# Altium project USB-C_BREAKOUT.PrjPcb
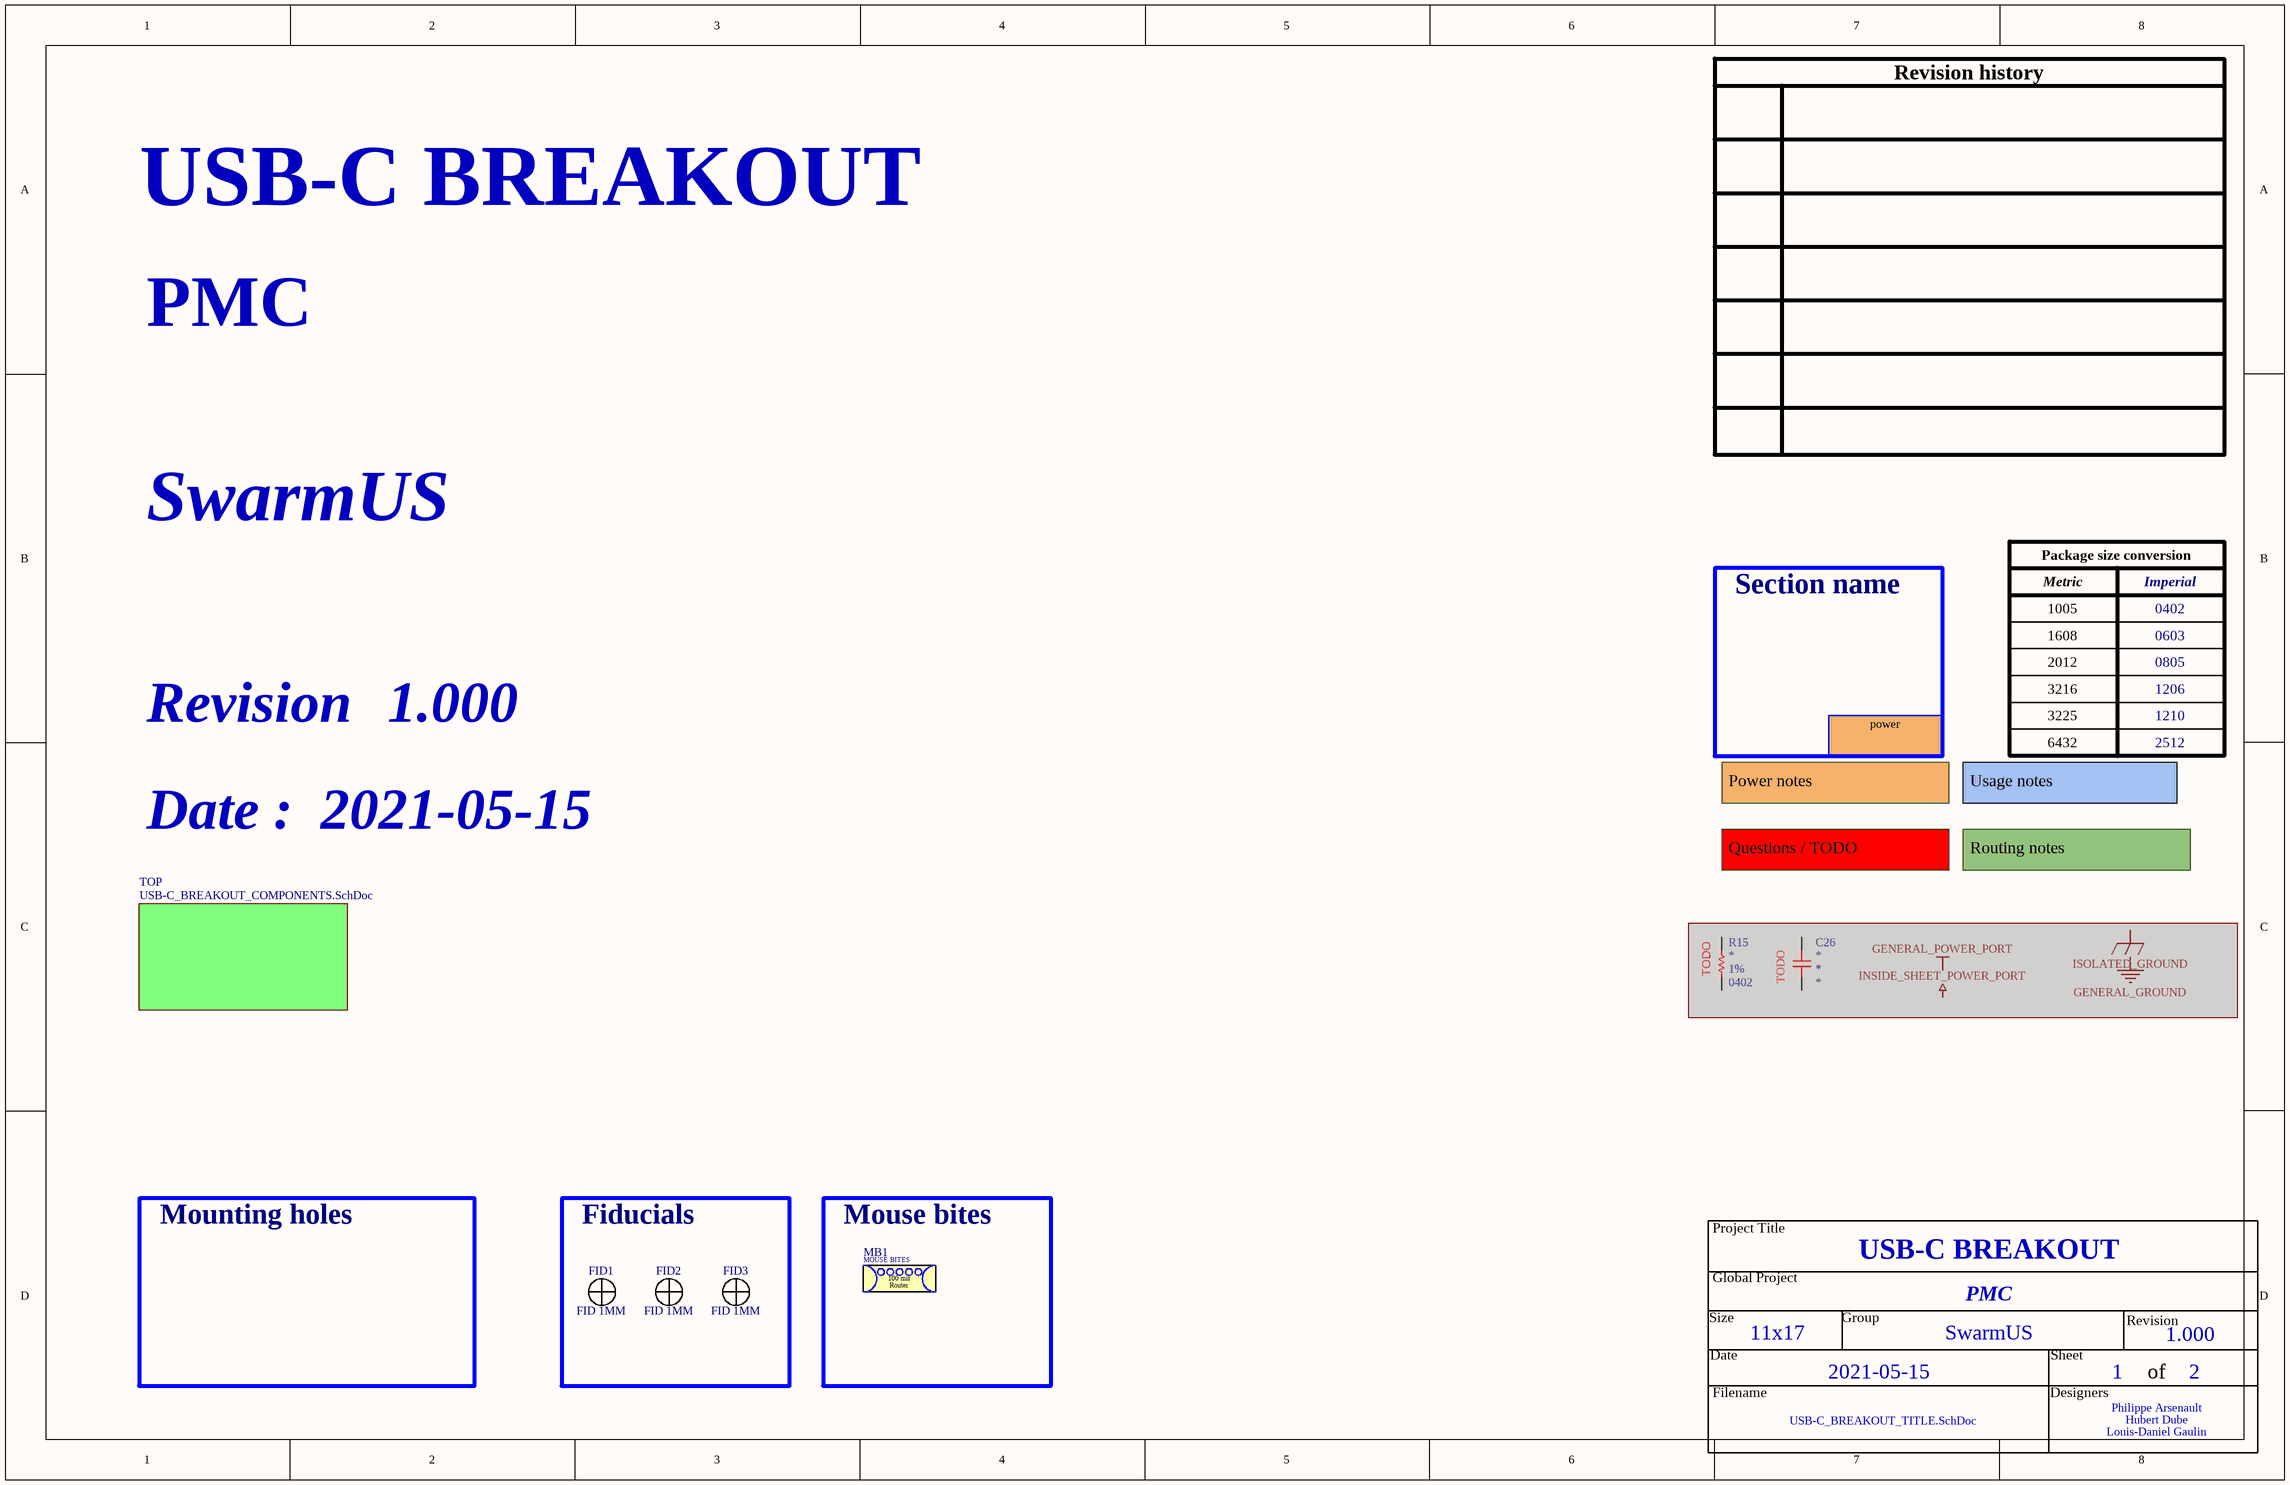
[diagram p0: USB-C_BREAKOUT_TITLE.SchDoc]
Project_Date: 2021-05-15; Project_Designer1: Philippe Arsenault; Project_Designer2: Hubert Dube; Project_Designer3: Louis-Daniel Gaulin; Project_Global: PMC; Project_Group: SwarmUS; Project_Name: USB-C BREAKOUT; Project_Revision: 1.000; Project_Stencil_Bot_Thickness: 0.1 MM; Project_Stencil_Top_Thickness: 0.1 MM
2 sheets, 21 parts. Net scope: hierarchical (ports join the sheet entries above them; power ports are global).
Board files: USB-C_BREAKOUT.PcbDoc, USB-C_BREAKOUT_PANNEL.PcbDoc
Sheets:
  USB-C_BREAKOUT_TITLE.SchDoc
    TOP = USB-C_BREAKOUT_COMPONENTS.SchDoc

## Sheet USB-C_BREAKOUT_TITLE.SchDoc
size Tabloid; DocumentNumber: 1; SheetNumber: 1; SheetTotal: 2; Sheet_Name: Title sheet; Size: 11x17

### Parts
C26  PRELIM  [CAP_CER_1812]  (value not drawn)  (masked out: inside a compile mask, not in the netlist)
FID1  FID 1MM  [FID_CIRCLE_1MM]
FID2  FID 1MM  [FID_CIRCLE_1MM]
FID3  FID 1MM  [FID_CIRCLE_1MM]
MB1  MOUSE BITES  [PNL_MOUSEBITES_100MIL_5-HOLES]  (no BOM)
R15  Tolerance: 1%  Package: 0402  [RES_0402]  (hidden comment: PRELIM)  (masked out: inside a compile mask, not in the netlist)

### Blocks framed on the sheet
Fiducials: FID1-FID3
Mouse bites: MB1

### Sub-sheets
TOP = USB-C_BREAKOUT_COMPONENTS.SchDoc: no entries

### Nets

Not connected (* = marked no-connect by the designer): FID1 1 2; FID2 1 2; FID3 1 2

### Notes on the sheet
- Section name
- power
- Power notes
- Usage notes
- Questions / TODO
- Routing notes
- Mounting holes
- Revision history
- Package size conversion
- Metric
- 1005
- 1608
- Imperial
- 0402
- 0603
- Revision
- 2012
- 3216
- 0805
- 1206
- 3225
- 6432
- 1210
- 2512
- Date :
- Project Title
- Global Project
- Size
- Date
- Group
- Sheet
- of
- Filename
- Designers
- (in symbol CAP_CER_PRELIM) TODO
- (in symbol PNL_MOUSEBITES_100MIL_5-HOLES) 100 mil; Router
- (in symbol RES_PRELIM) TODO

### Library data of the parts
C26 = CAP_CER_PRELIM: CAP - CER PRELIM; Manufacturer #1: Würth Elektronik; Part Number #1: 885342211009; Tolerance: 10%; GRAMS Lib Spec: 2.8; Magnetic Material: Unknown; Polarized: No; Current Rating: *; Power Max: *; HelpURL: http://www.vishay.com/docs/45228/hvseries.pdf; CreatedBy/Date: Hubert Dube - 03/02/2021; Temperature: -55°C ~ 125°C; Manufacturer #2: *; Note: *; Assembly Type: SMD; Part Number #2: *; Cryo: UNKNOWN; Supplier 1: Digi-Key; Supplier Part Number 1: 732-12109-1-ND; Package: *; Voltage Rating: *; Value: *
FID1-FID3 = FID_CIRCLE_1MM: FID - FIDUCIAL 1MM CIRCLE DOUBLE-SIDED - 1MM; GRAMS Lib Spec: 2.8; Magnetic Material: NO; Cryo: UNKNOWN; Value: *; Tolerance: *; Voltage Rating: *; Current Rating: *; Power Max: *; HelpURL: https://www.pcb-3d.com/wordpress/wp-content/uploads/ipc-sm-782a_amendment_1_and_2.pdf; CreatedBy/Date: Jonathan Bouchard 2018-07-23; VerifiedBy: Caroline Paulin - 25 juillet 2018; Temperature: *; Package: 1MM CIRCLE; Manufacturer #1: *; Manufacturer #2: *; Note: *; Assembly Type: NONE; Part Number #2: *; Part Number #1: *; Polarized: *; Supplier 1: *; Supplier Part Number 1: *
MB1 = PNL_MOUSEBITES_100MIL_5-HOLES: PNL - MOUSE BITES 100 MIL - 5-TH; GRAMS Lib Spec: 2.8; Magnetic Material: NO; Rule: UNIONINDEX=0|RULEKIND=ComponentClearance|NETSCOPE=AnyNet|LAYERKIND=SameLayer|NAME=Schematic Component Clearance Constraint|GAP=0mil|COLLISIONCHECKMODE=3|VERTICALGAP=0mil|SHOWDISTANCES=FALSE|UNIT=Imperial; Rule: UNIONINDEX=0|RULEKIND=PlaneClearance|NETSCOPE=AnyNet|LAYERKIND=SameLayer|NAME=Schematic Power Plane Clearance|CLEARANCE=20mil|UNIT=Imperial; Cryo: UNKNOWN; Value: *; Tolerance: *; Voltage Rating: *; Current Rating: *; Power Max: *; HelpURL: *; CreatedBy/Date: Jonathan Bouchard 2019-04-15; VerifiedBy: Caroline Paulin - 24 mai 2019; Temperature: *; Package: *; Manufacturer #1: *; Manufacturer #2: *; Note: *; Assembly Type: NONE; Part Number #2: *; Part Number #1: *; Polarized: *; Supplier 1: *; Supplier Part Number 1: *
R15 = RES_PRELIM: RES -PRELIM; Manufacturer #1: Yageo; Part Number #1: RC0402FR-0775RL; GRAMS Lib Spec: 2.8c; Power Max: 1/16W; Magnetic Material: Unknown; Polarized: No; Voltage Rating: 50V; Assembly Type: SMD; CreatedBy/Date: Hubert Dubé - 3/02/2020; Current Rating: *; HelpURL: https://www.yageo.com/upload/media/product/productsearch/datasheet/rchip/PYu-RC_Group_51_RoHS_L_11.pdf; Manufacturer #2: *; Note: *; Part Number #2: *; Temperature: -55°C ~ 155°C; Value: *

## Sheet USB-C_BREAKOUT_COMPONENTS.SchDoc
size Tabloid; DocumentNumber: 2; SheetNumber: 2; SheetTotal: 2; Sheet_Name: USB-C Breakout; Size: 11x17
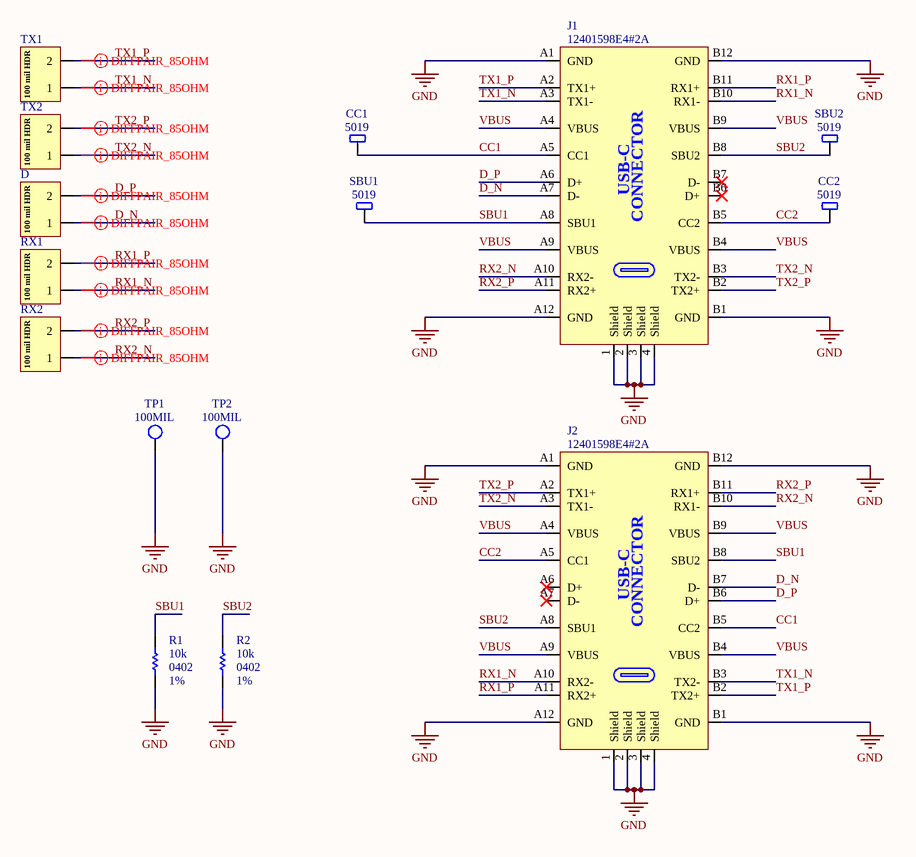
[diagram p1: USB-C_BREAKOUT_COMPONENTS.SchDoc]

### Parts
CC1  5019  [TPO_SMD_5019]
CC2  5019  [TPO_SMD_5019]
D  TS-102-G-A  [CON_HDR_TS-102-G-A]  (value not drawn)
J1  12401598E4#2A  [CON_USB_3.2_TypeC_12401598E4#2A]
J2  12401598E4#2A  [CON_USB_3.2_TypeC_12401598E4#2A]
R1  value 10k  Tolerance: 1%  Package: 0402  [RES_0402]  (hidden comment: RC0402FR-0710KL)
R2  value 10k  Tolerance: 1%  Package: 0402  [RES_0402]  (hidden comment: RC0402FR-0710KL)
RX1  TS-102-G-A  [CON_HDR_TS-102-G-A]  (value not drawn)
RX2  TS-102-G-A  [CON_HDR_TS-102-G-A]  (value not drawn)
SBU1  5019  [TPO_SMD_5019]
SBU2  5019  [TPO_SMD_5019]
TP1  100MIL  [TPO_TH_ROUND_100MIL]  (no BOM)
TP2  100MIL  [TPO_TH_ROUND_100MIL]  (no BOM)
TX1  TS-102-G-A  [CON_HDR_TS-102-G-A]  (value not drawn)
TX2  TS-102-G-A  [CON_HDR_TS-102-G-A]  (value not drawn)

### Nets
GND: J1.1(Shield) J1.2(Shield) J1.3(Shield) J1.4(Shield) J1.A1(GND) J1.A12(GND) J1.B1(GND) J1.B12(GND) J2.1(Shield) J2.2(Shield) J2.3(Shield) J2.4(Shield) J2.A1(GND) J2.A12(GND) J2.B1(GND) J2.B12(GND) R1.2 R2.2 TP1.1 TP2.1
CC1: CC1.1 J1.A5(CC1) J2.B5(CC2)
CC2: CC2.1 J1.B5(CC2) J2.A5(CC1)
D_N: D.1 J1.A7(D-) J2.B7(D-)
D_P: D.2 J1.A6(D+) J2.B6(D+)
RX1_N: J1.B10(RX1-) J2.A10(RX2-) RX1.1
RX1_P: J1.B11(RX1+) J2.A11(RX2+) RX1.2
RX2_N: J1.A10(RX2-) J2.B10(RX1-) RX2.1
RX2_P: J1.A11(RX2+) J2.B11(RX1+) RX2.2
SBU1: J1.A8(SBU1) J2.B8(SBU2) R1.1 SBU1.1
SBU2: J1.B8(SBU2) J2.A8(SBU1) R2.1 SBU2.1
TX1_N: J1.A3(TX1-) J2.B3(TX2-) TX1.1
TX1_P: J1.A2(TX1+) J2.B2(TX2+) TX1.2
TX2_N: J1.B3(TX2-) J2.A3(TX1-) TX2.1
TX2_P: J1.B2(TX2+) J2.A2(TX1+) TX2.2
VBUS: J1.A4(VBUS) J1.A9(VBUS) J1.B4(VBUS) J1.B9(VBUS) J2.A4(VBUS) J2.A9(VBUS) J2.B4(VBUS) J2.B9(VBUS)

Not connected (* = marked no-connect by the designer): J1 B6(D+)* B7(D-)*; J2 A6(D+)* A7(D-)*

### Layout directives
differential pair; differential pair class DIFF_85; net class DIFF: D_N, D_P, RX1_N, RX1_P, RX2_N, RX2_P, TX1_N, TX1_P, TX2_N, TX2_P

### Notes on the sheet
- Sheet Name
- Project Title
- Global Project
- Size
- Group
- Revision
- Date
- Sheet
- of
- Filename
- Designers
- (in symbol CON_HDR_TS-102-G-A) 100 mil HDR
- (in symbol CON_USB_3.2_TypeC_12401598E4#2A) USB-C; CONNECTOR

### Library data of the parts
CC1 CC2 SBU1 SBU2 = TPO_SMD_5019: TPO - PC TEST POINT MINI - SMD; Manufacturer #1: Keystone Electronics; Value: 3.81mm x 2.03mm; Polarized: No; Magnetic Material: UNKNOWN; GRAMS Lib Spec: 2.8; Current Rating: *; Manufacturer #2: *; Note: *; Power Max: *; Part Number #2: *; HelpURL: https://www.digikey.ca/product-detail/en/keystone-electronics/5019/36-5019CT-ND/3907344; Supplier 1: Digi-Key; Supplier Part Number 1: 36-5019CT-ND; Assembly Type: SMD; Part Number #1: 5019; Package: SMD; CreatedBy/Date: Olivier Bernard / 5/12/2017; Temperature: *; Tolerance: *; VerifiedBy: Caroline Paulin / 5 juillet 2018; Voltage Rating: *; Cryo: UNKNOWN
D RX1 RX2 TX1 TX2 = CON_HDR_TS-102-G-A: CON - HDR 2 position 0.100" - TH; Manufacturer #1: Samtec Inc.; GRAMS Lib Spec: 2.8; Magnetic Material: Unknown; Polarized: No; Assembly Type: TH; CreatedBy/Date: Joel Lemay 2018-06-19; Current Rating: *; HelpURL: http://suddendocs.samtec.com/prints/tx-1xx-x-x-mkt1.pdf; Manufacturer #2: *; Package: TH; Part Number #2: *; Power Max: *; Supplier 1: Digi-Key; Supplier Part Number 1: SAM1111-02-ND; Temperature: -55°C ~ 125°C; Tolerance: *; Value: *; VerifiedBy: Caroline Paulin - 10 sept 2018; Voltage Rating: *; Part Number #1: TS-102-G-A; Cryo: UNKNOWN
J1 J2 = CON_USB_3.2_TypeC_12401598E4#2A: CON_USB - USB 3.2 Gen 2 (USB 3.1 Gen 2, Superspeed + (USB 3.1)) 24 pos Receptacle - R/A; Manufacturer #1: Amphenol ICC (Commercial Products); Value: USB 3.2 Type C; Current Rating: 5A total; GRAMS Lib Spec: 2.8; Magnetic Material: Unknown; Polarized: Yes; Voltage Rating: -; Power Max: -; HelpURL: https://www.amphenol-icc.com/media/wysiwyg/files/drawing/12401598xxx2a.pdf; CreatedBy/Date: Louis-Daniel Gaulin / 07-04-2021; VerifiedBy: Philippe Arsenault/2021-04-08; Temperature: max 105°C; Package: SMD + TH R/A; Assembly Type: SMD + TH; Part Number #1: 12401598E4#2A; Supplier 1: Digi-Key; Supplier Part Number 1: 12401598E4#2ACT-ND
R1 R2 = RES_RC0402FR-0710KL: RES - 10K OHMS 1% 1/16W - 0402; Manufacturer #1: Yageo; GRAMS Lib Spec: 2.8; Magnetic Material: UNKNOWN; Polarized: NO; Voltage Rating: 50V; Assembly Type: SMD; CreatedBy/Date: Nicolas V. (2018-11-20); Current Rating: *; HelpURL: http://www.yageo.com/documents/recent/PYu-RC_Group_51_RoHS_L_9.pdf; Manufacturer #2: *; Note: *; Part Number #1: RC0402FR-0710KL; Part Number #2: *; Power Max: 1/16W; Temperature: -55°C ~ 155°C; VerifiedBy: Nicolas V. (2018-11-20); Supplier 1: Digi-Key; Supplier Part Number 1: 311-10.0KLRCT-ND; Cryo: UNKNOWN
TP1 TP2 = TPO_TH_ROUND_100MIL: TPO - TEST POINT ROUND TH  - 100MIL; Magnetic Material: NO; GRAMS Lib Spec: 2.8c; Cryo: UNKNOWN; Current Rating: *; Manufacturer #1: *; Manufacturer #2: *; Note: *; Power Max: *; Value: *; Part Number #1: *; Part Number #2: *; HelpURL: *; Polarized: *; Supplier 1: *; Assembly Type: NONE; Supplier Part Number 1: *; Package: 100 MIL round; CreatedBy/Date: Louis-Daniel Gaulin/ 14/01/2020; Temperature: *; Tolerance: *; VerifiedBy: C.Paulin - 21/01/2020; Voltage Rating: *